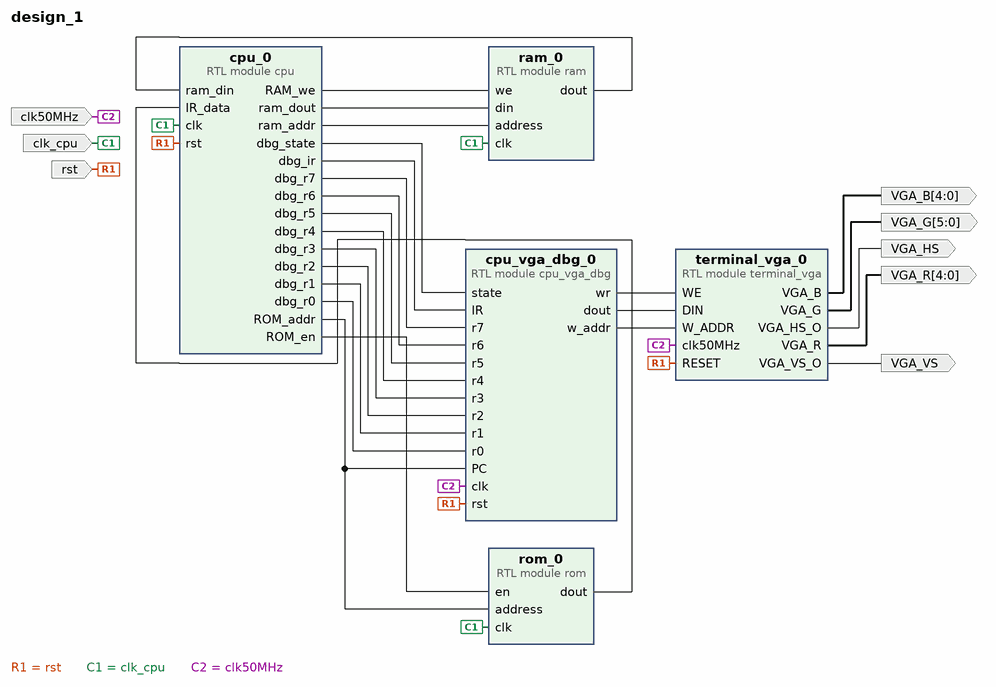
[diagram p0: block diagram of the top level]
# Vivado block design design_1, xc7z010clg400-1, Vivado 2020.1
create_bd_design design_1

create_bd_port -dir I -type rst rst
create_bd_port -dir I -type clk clk_cpu
create_bd_port -dir I clk50MHz
create_bd_port -dir O VGA_HS
create_bd_port -dir O VGA_VS
create_bd_port -dir O -from 4 -to 0 VGA_R
create_bd_port -dir O -from 4 -to 0 VGA_B
create_bd_port -dir O -from 5 -to 0 VGA_G

create_bd_cell -type module -reference cpu cpu_0
create_bd_cell -type module -reference terminal_vga terminal_vga_0
create_bd_cell -type module -reference cpu_vga_dbg cpu_vga_dbg_0
create_bd_cell -type module -reference ram ram_0
create_bd_cell -type module -reference rom rom_0

# ---- connections ----

connect_bd_net [get_bd_pins cpu_0/dbg_state] [get_bd_pins cpu_vga_dbg_0/state]
connect_bd_net [get_bd_pins cpu_0/dbg_ir] [get_bd_pins cpu_vga_dbg_0/IR]
connect_bd_net [get_bd_pins cpu_0/dbg_r7] [get_bd_pins cpu_vga_dbg_0/r7]
connect_bd_net [get_bd_pins cpu_0/dbg_r6] [get_bd_pins cpu_vga_dbg_0/r6]
connect_bd_net [get_bd_pins cpu_0/dbg_r5] [get_bd_pins cpu_vga_dbg_0/r5]
connect_bd_net [get_bd_pins cpu_0/ROM_addr] [get_bd_pins cpu_vga_dbg_0/PC] [get_bd_pins rom_0/address]
connect_bd_net [get_bd_pins cpu_0/dbg_r4] [get_bd_pins cpu_vga_dbg_0/r4]
connect_bd_net [get_bd_pins cpu_0/dbg_r3] [get_bd_pins cpu_vga_dbg_0/r3]
connect_bd_net [get_bd_pins cpu_0/dbg_r2] [get_bd_pins cpu_vga_dbg_0/r2]
connect_bd_net [get_bd_pins cpu_0/dbg_r1] [get_bd_pins cpu_vga_dbg_0/r1]
connect_bd_net [get_bd_pins cpu_0/dbg_r0] [get_bd_pins cpu_vga_dbg_0/r0]
connect_bd_net [get_bd_pins cpu_0/RAM_we] [get_bd_pins ram_0/we]
connect_bd_net [get_bd_pins cpu_0/ram_dout] [get_bd_pins ram_0/din]
connect_bd_net [get_bd_pins cpu_0/ram_addr] [get_bd_pins ram_0/address]
connect_bd_net [get_bd_pins cpu_0/ROM_en] [get_bd_pins rom_0/en]
connect_bd_net [get_bd_pins ram_0/dout] [get_bd_pins cpu_0/ram_din]
connect_bd_net [get_bd_pins rom_0/dout] [get_bd_pins cpu_0/IR_data]
connect_bd_net [get_bd_pins cpu_vga_dbg_0/wr] [get_bd_pins terminal_vga_0/WE]
connect_bd_net [get_bd_pins cpu_vga_dbg_0/dout] [get_bd_pins terminal_vga_0/DIN]
connect_bd_net [get_bd_pins cpu_vga_dbg_0/w_addr] [get_bd_pins terminal_vga_0/W_ADDR]
connect_bd_net -net rst_0_1 [get_bd_ports rst] [get_bd_pins cpu_0/rst] [get_bd_pins cpu_vga_dbg_0/rst] [get_bd_pins terminal_vga_0/RESET]
connect_bd_net -net clk_0_1 [get_bd_ports clk_cpu] [get_bd_pins cpu_0/clk] [get_bd_pins ram_0/clk] [get_bd_pins rom_0/clk]
connect_bd_net -net clk50MHz_0_1 [get_bd_ports clk50MHz] [get_bd_pins terminal_vga_0/clk50MHz] [get_bd_pins cpu_vga_dbg_0/clk]
connect_bd_net [get_bd_pins terminal_vga_0/VGA_HS_O] [get_bd_ports VGA_HS]
connect_bd_net [get_bd_pins terminal_vga_0/VGA_VS_O] [get_bd_ports VGA_VS]
connect_bd_net [get_bd_pins terminal_vga_0/VGA_R] [get_bd_ports VGA_R]
connect_bd_net [get_bd_pins terminal_vga_0/VGA_B] [get_bd_ports VGA_B]
connect_bd_net [get_bd_pins terminal_vga_0/VGA_G] [get_bd_ports VGA_G]

validate_bd_design
save_bd_design
